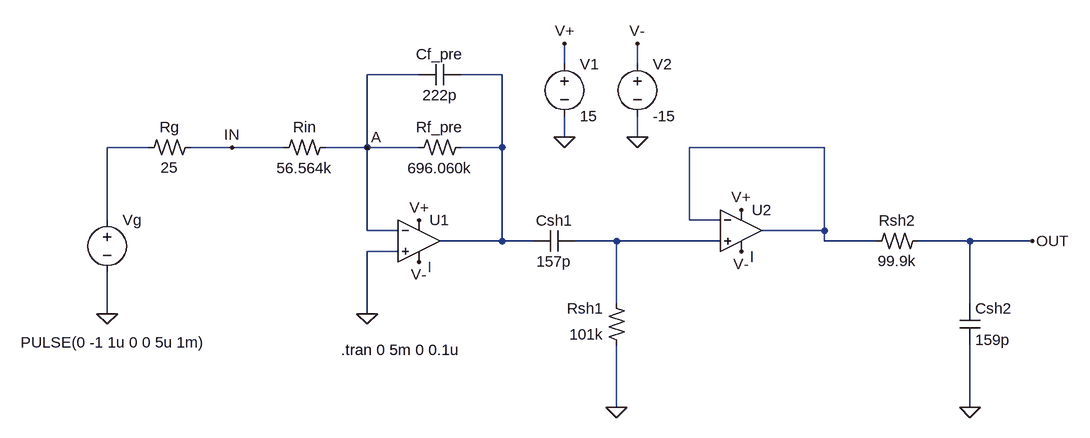
[diagram p0: schematic Shaper_PreAmp_base.asc]
Shaper_PreAmp_base.asc, the LTspice schematic file:
Version 4
SHEET 1 1540 680
WIRE 608 -80 608 -112
WIRE 720 -80 720 -112
WIRE 384 -64 304 -64
WIRE 512 -64 448 -64
WIRE 608 32 608 0
WIRE 720 32 720 0
WIRE -32 48 -96 48
WIRE 96 48 32 48
WIRE 176 48 96 48
WIRE 304 48 304 -64
WIRE 304 48 240 48
WIRE 384 48 304 48
WIRE 512 48 512 -64
WIRE 512 48 448 48
WIRE 1008 48 800 48
WIRE -96 160 -96 48
WIRE 800 160 800 48
WIRE 848 160 800 160
WIRE 304 176 304 48
WIRE 352 176 304 176
WIRE 1008 176 1008 48
WIRE 1008 176 912 176
WIRE 512 192 512 48
WIRE 512 192 416 192
WIRE 560 192 512 192
WIRE 688 192 624 192
WIRE 848 192 688 192
WIRE 1008 192 1008 176
WIRE 1088 192 1008 192
WIRE 1232 192 1152 192
WIRE 1328 192 1232 192
WIRE 352 208 304 208
WIRE 896 224 896 208
WIRE 400 240 400 224
WIRE 688 288 688 192
WIRE 1232 288 1232 192
WIRE -96 304 -96 240
WIRE 304 304 304 208
WIRE 688 448 688 352
WIRE 1232 448 1232 352
FLAG 608 32 0
FLAG 720 32 0
FLAG 608 -112 V+
FLAG 720 -112 V-
FLAG 304 304 0
FLAG 96 48 IN
FLAG 384 224 V-
FLAG 384 160 V+
FLAG -96 304 0
FLAG 304 48 A
FLAG 880 208 V-
FLAG 880 144 V+
FLAG 688 448 0
FLAG 1232 448 0
FLAG 1328 192 OUT
SYMBOL voltage 608 -96 R0
WINDOW 123 24 126 Left 2
WINDOW 39 24 111 Left 2
SYMATTR InstName V1
SYMATTR Value 15
SYMBOL voltage 720 -96 R0
WINDOW 123 24 126 Left 2
WINDOW 39 24 111 Left 2
SYMATTR InstName V2
SYMATTR Value -15
SYMBOL Opamps/UniversalOpamp2 384 192 R0
SYMATTR InstName U1
SYMBOL res2 240 32 R90
WINDOW 0 0 32 VBottom 2
WINDOW 3 32 32 VTop 2
SYMATTR InstName Rin
SYMATTR Value 56.564k
SYMBOL res2 448 32 R90
WINDOW 0 0 32 VBottom 2
WINDOW 3 32 32 VTop 2
SYMATTR InstName Rf_pre
SYMATTR Value 696.060k
SYMBOL res2 32 32 R90
WINDOW 0 0 32 VBottom 2
WINDOW 3 31 32 VTop 2
SYMATTR InstName Rg
SYMATTR Value 25
SYMBOL voltage -96 144 R0
WINDOW 3 -133 204 Left 2
WINDOW 123 0 0 Left 0
WINDOW 39 0 0 Left 0
SYMATTR Value PULSE(0 -1 1u 0 0 5u 1m)
SYMATTR InstName Vg
SYMBOL cap 448 -80 R90
WINDOW 0 0 32 VBottom 2
WINDOW 3 32 32 VTop 2
SYMATTR InstName Cf_pre
SYMATTR Value 222p
SYMBOL Opamps/UniversalOpamp2 880 176 R0
SYMATTR InstName U2
SYMBOL cap 624 176 R90
WINDOW 0 0 32 VBottom 2
WINDOW 3 32 32 VTop 2
SYMATTR InstName Csh1
SYMATTR Value 157p
SYMBOL res2 704 352 R180
WINDOW 0 36 56 Left 2
WINDOW 3 36 16 Left 2
SYMATTR InstName Rsh1
SYMATTR Value 101k
SYMBOL res2 1152 176 R90
WINDOW 0 0 32 VBottom 2
WINDOW 3 31 32 VTop 2
SYMATTR InstName Rsh2
SYMATTR Value 99.9k
SYMBOL cap 1216 288 R0
SYMATTR InstName Csh2
SYMATTR Value 159p
TEXT 264 360 Left 2 !.tran 0 5m 0 0.1u

The netlist it stands for:
* Shaper_PreAmp_base.asc
V1 V+ 0 15
V2 V- 0 -15
XU1 0 A V+ V- N001 level.2 Avol=1Meg GBW=10Meg Slew=10Meg ilimit=25m rail=0 Vos=0 phimargin=45 en=0 enk=0 in=0 ink=0 Rin=500Meg  ; pins IN+ IN- V+ V- OUT
Rin A IN 56.564k
Rf_pre N001 A 696.060k
Rg IN N002 25
Vg N002 0 PULSE(0 -1 1u 0 0 5u 1m)
Cf_pre N001 A 222p
XU2 N004 N003 V+ V- N003 level.2 Avol=1Meg GBW=10Meg Slew=10Meg ilimit=25m rail=0 Vos=0 phimargin=45 en=0 enk=0 in=0 ink=0 Rin=500Meg  ; pins IN+ IN- V+ V- OUT
Csh1 N004 N001 157p
Rsh1 0 N004 101k
Rsh2 OUT N003 99.9k
Csh2 OUT 0 159p
.tran 0 5m 0 0.1u
.lib UniversalOpamps2.sub
.backanno
.end

* Results of the author's LTspice run, read from the files saved beside the schematic
* Operating Point, zero values left out:
*   V(v+) = 15 V
*   V(v-) = -15 V
*   I(V2) = 2.997 mA
*   I(V1) = -2.997 mA
*   Ix(u1:3) = 1.498 mA
*   Ix(u1:4) = -1.498 mA
*   Ix(u2:3) = 1.498 mA
*   Ix(u2:4) = -1.498 mA
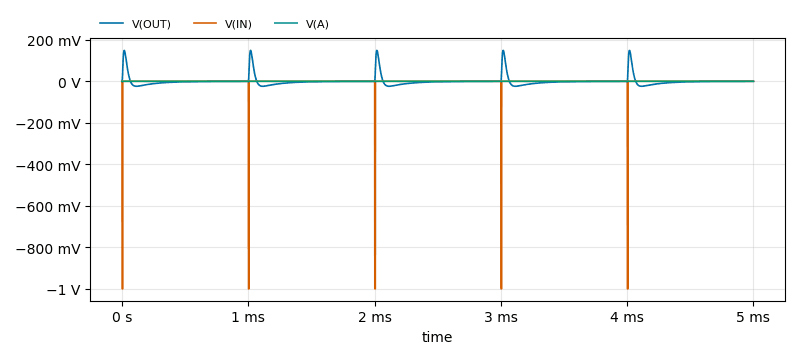
[diagram p1: Transient Analysis of Shaper_PreAmp_base.asc, plotted from the saved traces]
* Transient Analysis, 1 run:
*   V(OUT): min -24.01 mV, max 149 mV, average -17.36 µV, rms 24.81 mV, last -89.2 µV
*   V(IN): min -999.6 mV, max 938.5 nV, average -5.498 mV, rms 73.06 mV, last 0 V
*   V(A): min -1.273 mV, max 44.4 µV, average -57.85 nV, rms 91.75 µV, last 71.52 nV